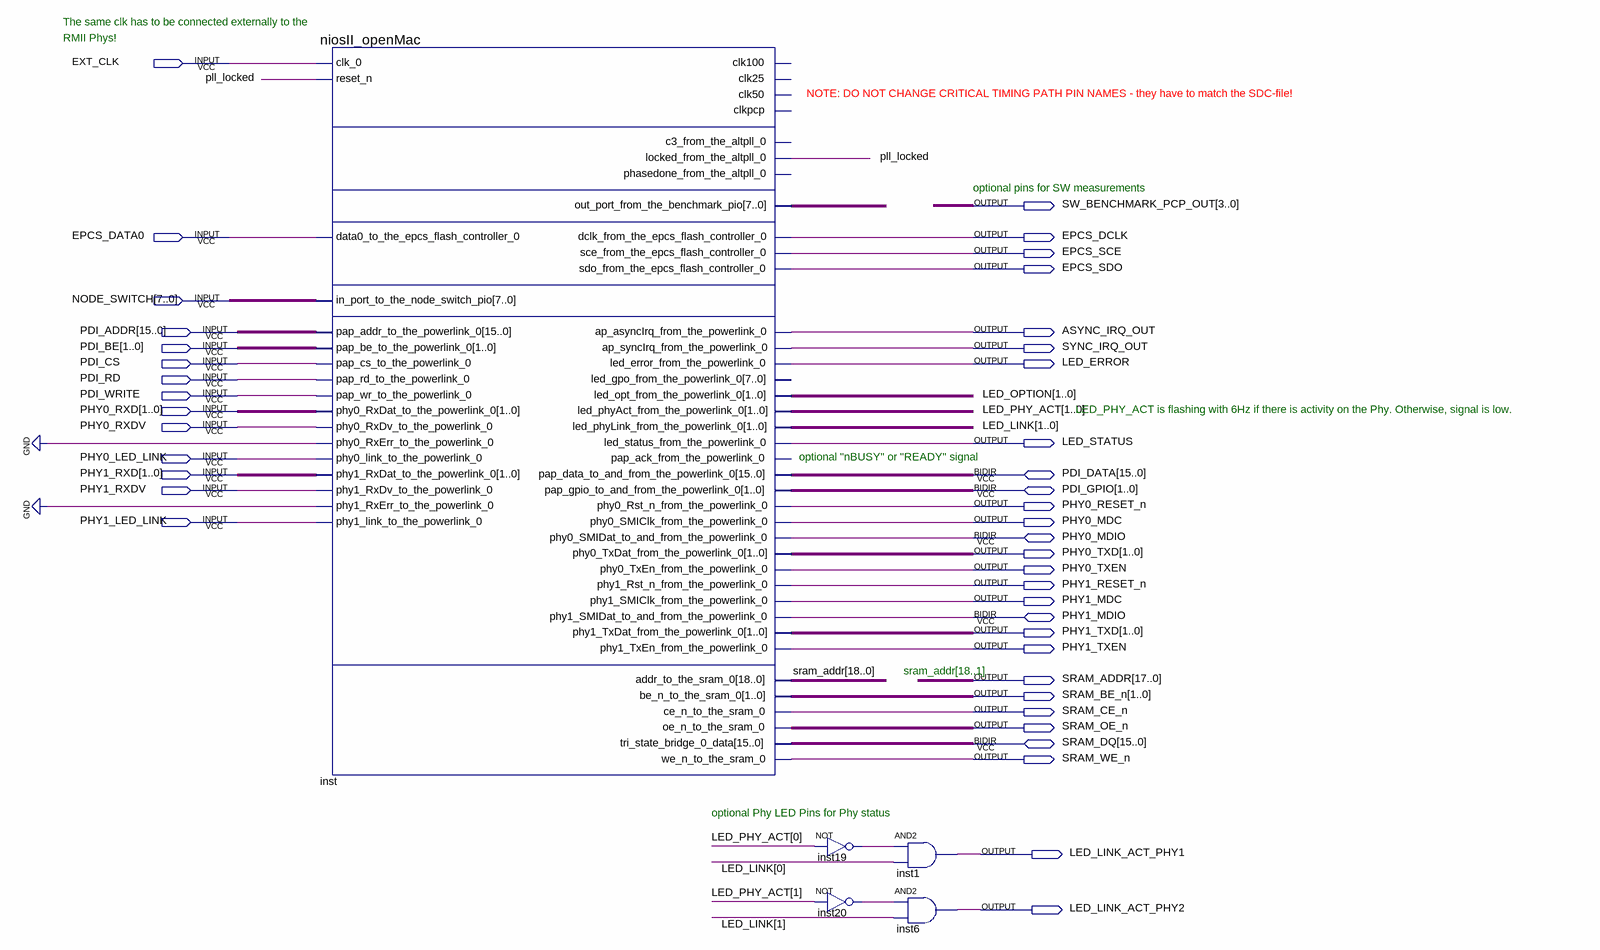
[diagram p0: schematic sheet]
// Quartus schematic nios_pll.bdf as structural Verilog: 5 symbols, 42 pins
module nios_pll (
  input  EXT_CLK,
  input  EPCS_DATA0,
  input  [7:0] NODE_SWITCH,
  input  [15:0] PDI_ADDR,
  input  [1:0] PDI_BE,
  input  PDI_CS,
  input  PDI_RD,
  input  PDI_WRITE,
  input  [1:0] PHY0_RXD,
  input  PHY0_RXDV,
  input  PHY0_LED_LINK,
  input  [1:0] PHY1_RXD,
  input  PHY1_RXDV,
  input  PHY1_LED_LINK,
  inout  [15:0] PDI_DATA,
  inout  [1:0] PDI_GPIO,
  inout  PHY0_MDIO,
  inout  PHY1_MDIO,
  inout  [15:0] SRAM_DQ,
  output [3:0] SW_BENCHMARK_PCP_OUT,
  output EPCS_DCLK,
  output EPCS_SCE,
  output EPCS_SDO,
  output ASYNC_IRQ_OUT,
  output SYNC_IRQ_OUT,
  output LED_ERROR,
  output LED_STATUS,
  output PHY0_RESET_n,
  output PHY0_MDC,
  output [1:0] PHY0_TXD,
  output PHY0_TXEN,
  output PHY1_RESET_n,
  output PHY1_MDC,
  output [1:0] PHY1_TXD,
  output PHY1_TXEN,
  output [18:0] SRAM_ADDR,
  output [1:0] SRAM_BE_n,
  output SRAM_CE_n,
  output SRAM_OE_n,
  output SRAM_WE_n,
  output LED_LINK_ACT_PHY1,
  output LED_LINK_ACT_PHY2
);

  wire inst19_out, inst20_out, pll_locked;
  wire [1:0] LED_LINK, LED_OPTION, LED_PHY_ACT;
  wire [7:0] inst_out_port_from_the_benchmark_pio;

  niosII_openMac inst (
    .clk_0(EXT_CLK), .reset_n(pll_locked), .data0_to_the_epcs_flash_controller_0(EPCS_DATA0),
    .in_port_to_the_node_switch_pio(NODE_SWITCH), .pap_addr_to_the_powerlink_0(PDI_ADDR),
    .pap_be_to_the_powerlink_0(PDI_BE), .pap_cs_to_the_powerlink_0(PDI_CS),
    .pap_rd_to_the_powerlink_0(PDI_RD), .pap_wr_to_the_powerlink_0(PDI_WRITE),
    .phy0_RxDat_to_the_powerlink_0(PHY0_RXD), .phy0_RxDv_to_the_powerlink_0(PHY0_RXDV),
    .phy0_RxErr_to_the_powerlink_0(1'b0), .phy0_link_to_the_powerlink_0(PHY0_LED_LINK),
    .phy1_RxDat_to_the_powerlink_0(PHY1_RXD), .phy1_RxDv_to_the_powerlink_0(PHY1_RXDV),
    .phy1_RxErr_to_the_powerlink_0(1'b0), .phy1_link_to_the_powerlink_0(PHY1_LED_LINK),
    .locked_from_the_altpll_0(pll_locked),
    .out_port_from_the_benchmark_pio(inst_out_port_from_the_benchmark_pio),
    .dclk_from_the_epcs_flash_controller_0(EPCS_DCLK), .sce_from_the_epcs_flash_controller_0(EPCS_SCE),
    .sdo_from_the_epcs_flash_controller_0(EPCS_SDO), .ap_asyncIrq_from_the_powerlink_0(ASYNC_IRQ_OUT),
    .ap_syncIrq_from_the_powerlink_0(SYNC_IRQ_OUT), .led_error_from_the_powerlink_0(LED_ERROR),
    .led_opt_from_the_powerlink_0(LED_OPTION), .led_phyAct_from_the_powerlink_0(LED_PHY_ACT),
    .led_phyLink_from_the_powerlink_0(LED_LINK), .led_status_from_the_powerlink_0(LED_STATUS),
    .phy0_Rst_n_from_the_powerlink_0(PHY0_RESET_n), .phy0_SMIClk_from_the_powerlink_0(PHY0_MDC),
    .phy0_TxDat_from_the_powerlink_0(PHY0_TXD), .phy0_TxEn_from_the_powerlink_0(PHY0_TXEN),
    .phy1_Rst_n_from_the_powerlink_0(PHY1_RESET_n), .phy1_SMIClk_from_the_powerlink_0(PHY1_MDC),
    .phy1_TxDat_from_the_powerlink_0(PHY1_TXD), .phy1_TxEn_from_the_powerlink_0(PHY1_TXEN),
    .addr_to_the_sram_0(SRAM_ADDR), .be_n_to_the_sram_0(SRAM_BE_n), .ce_n_to_the_sram_0(SRAM_CE_n),
    .oe_n_to_the_sram_0(SRAM_OE_n), .we_n_to_the_sram_0(SRAM_WE_n),
    .pap_data_to_and_from_the_powerlink_0(PDI_DATA), .pap_gpio_to_and_from_the_powerlink_0(PDI_GPIO),
    .phy0_SMIDat_to_and_from_the_powerlink_0(PHY0_MDIO), .phy1_SMIDat_to_and_from_the_powerlink_0(PHY1_MDIO),
    .tri_state_bridge_0_data(SRAM_DQ));  // open: clk100, clk25, clk50, clkpcp, c3_from_the_altpll_0, phasedone_from_the_altpll_0, led_gpo_from_the_powerlink_0, pap_ack_from_the_powerlink_0
  not inst19 (inst19_out, LED_PHY_ACT[0]);
  not inst20 (inst20_out, LED_PHY_ACT[1]);
  and inst1 (LED_LINK_ACT_PHY1, inst19_out, LED_LINK[0]);
  and inst6 (LED_LINK_ACT_PHY2, inst20_out, LED_LINK[1]);

  // Notes on the sheet:
  //   The same clk has to be connected externally to the
  //   RMII Phys!
  //   NOTE: DO NOT CHANGE CRITICAL TIMING PATH PIN NAMES - they have to match the SDC-file!
  //   optional pins for SW measurements
  //   LED_PHY_ACT is flashing with 6Hz if there is activity on the Phy. Otherwise, signal is low.
  //   optional "nBUSY" or "READY" signal
  //   sram_addr[18..1]
  //   optional Phy LED Pins for Phy status
endmodule
